# EAGLE design Sirena_555_version_final (EAGLE 7.7.0)
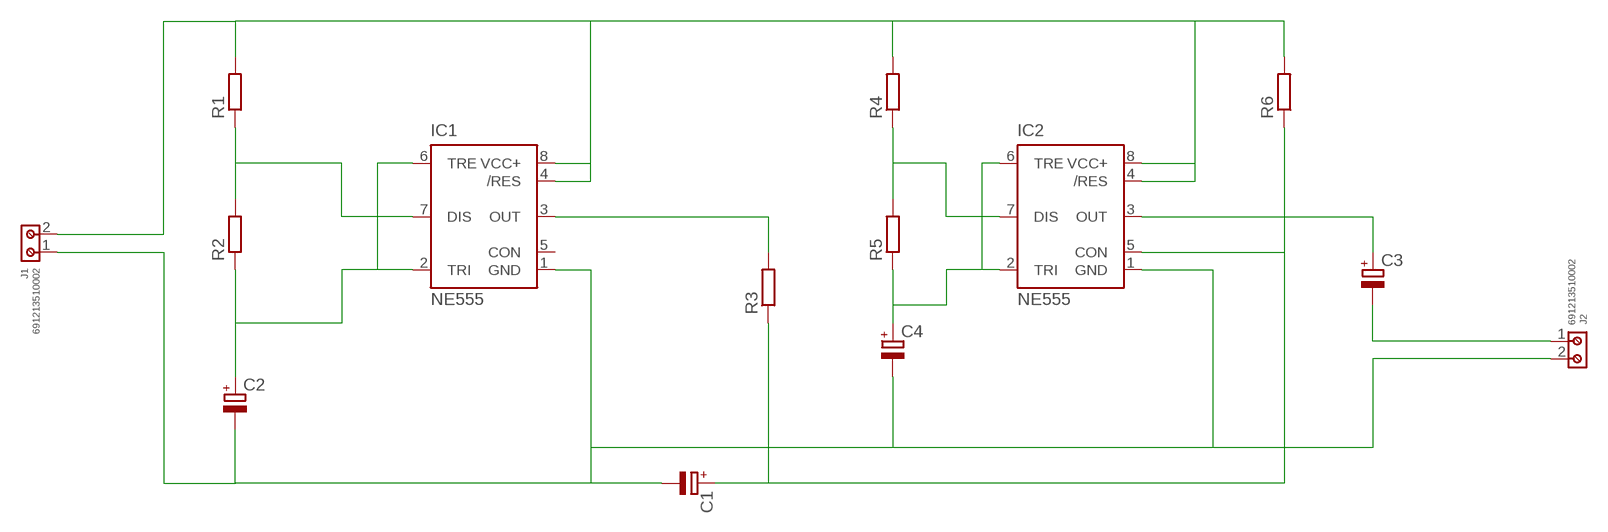
[diagram p0: schematic, sheet 1]

## Parts
C1  CPOL-EUE3.5-10  [E3,5-10]
C2  CPOL-EUE2.5-5  [E2,5-5]
C3  CPOL-EUE2.5-5  [E2,5-5]
C4  CPOL-EUE2-4  [E2-4]
IC1  NE555  [DIL-08]
IC2  NE555  [DIL-08]
J1  691213510002  [691213510002]
J2  691213510002  [691213510002]
R1  R-EU_0309/12  [0309/12]
R2  R-EU_0309/12  [0309/12]
R3  R-EU_0309/12  [0309/12]
R4  R-EU_0309/12  [0309/12]
R5  R-EU_0309/12  [0309/12]
R6  R-EU_0309/12  [0309/12]

## Nets
GROUND: C1.- C2.- C4.- IC1.1(GND) IC2.1(GND) J1.1 J2.2
N$1: IC1.4(/RES) IC1.8(VCC+) IC2.4(/RES) IC2.8(VCC+) J1.2 R1.2 R4.2 R6.2
N$3: IC1.7(DIS) R1.1 R2.2
N$4: C2.+ IC1.2(TRI) IC1.6(TRE) R2.1
N$5: C4.+ IC2.2(TRI) IC2.6(TRE) R5.1
N$9: IC1.3(OUT) R3.2
N$10: C1.+ IC2.5(CON) R3.1 R6.1
N$11: C3.- J2.1
N$12: IC2.7(DIS) R4.1 R5.2
N$15: C3.+ IC2.3(OUT)
Unconnected: IC1.5(CON)

## Library data of the parts
C1-C4 = rcl:CPOL-EU: POLARIZED CAPACITOR, European symbol
IC1 IC2 = st-microelectronics:NE555: General purpose bipolar Timer; MF: Arrow Electronics; MPN: NE555N; OC_FARNELL: 1467742; OC_NEWARK: 89K1486
J1 J2 = 691213510002:691213510002: WR-TBL Serie 2135 - 5.08 mm Horizontal Entry Modular w. Rising Cage Clamp KIND PROPERTIES Pitch 5.08 mm MATERIAL PROPERTIES Insulator Material PA66 Insulator Flammability Rating UL94 V-0 Contact Material Copper Alloy Contact Plating Tin over Nickel Contact Type Stamped Terminal Screw Material Steel Terminal Screw Plating Zinc Wire Guard Material Copper Alloy GENERAL INFORMATION Operating Temperature -30 up to +120 °C Compliance ROHS & Reach ELECTRICAL PROPERTIES IR UL 14 A IR VDE 14 A Working Voltage [UL] 300 V (AC) Working Voltage [VDE] 250 V (AC) Withstanding Voltage [UL] 1600 V (AC) Withstanding Voltage [VDE] 2000 V (AC) Contact Resistance 20 mΩ MECHANICAL PROPERTIES Wire Strip Length 6 Screw M3 CERTIFICATION UL Approval E150931 VDE Approval 40021366 PACKAGING PROPERTIES Packaging Box <https://www.we-online.com/catalog/media/o32805v209%20Family_WR-TBL2_Series2135.jpg> Details see: https://www.we-online.com/catalog/en/TBL_5_08_2135_HORIZONTAL_ENTRY_MODULAR_69121351000x/ Updated by Ella Wu 2019-11-26 2019(C) Wurth Elektronik Check availability <https://pricing.snapeda.com/parts/691213510002/Wurth%20Electronics/view-part?ref=eda>; AVAILABILITY: In Stock; CHECK_PRICES: https://www.snapeda.com/parts/691213510002/Wurth+Electronics/view-part/?ref=eda; DESCRIPTION: 2 Position Wire to Board Terminal Block Horizontal with Board 0.200 (5.08mm) Through Hole; MF: Wurth Electronics; MP: 691213510002; PACKAGE: None; PRICE: None; SNAPEDA_LINK: https://www.snapeda.com/parts/691213510002/Wurth+Electronics/view-part/?ref=snap
R1-R6 = rcl:R-EU_: RESISTOR, European symbol

## Board
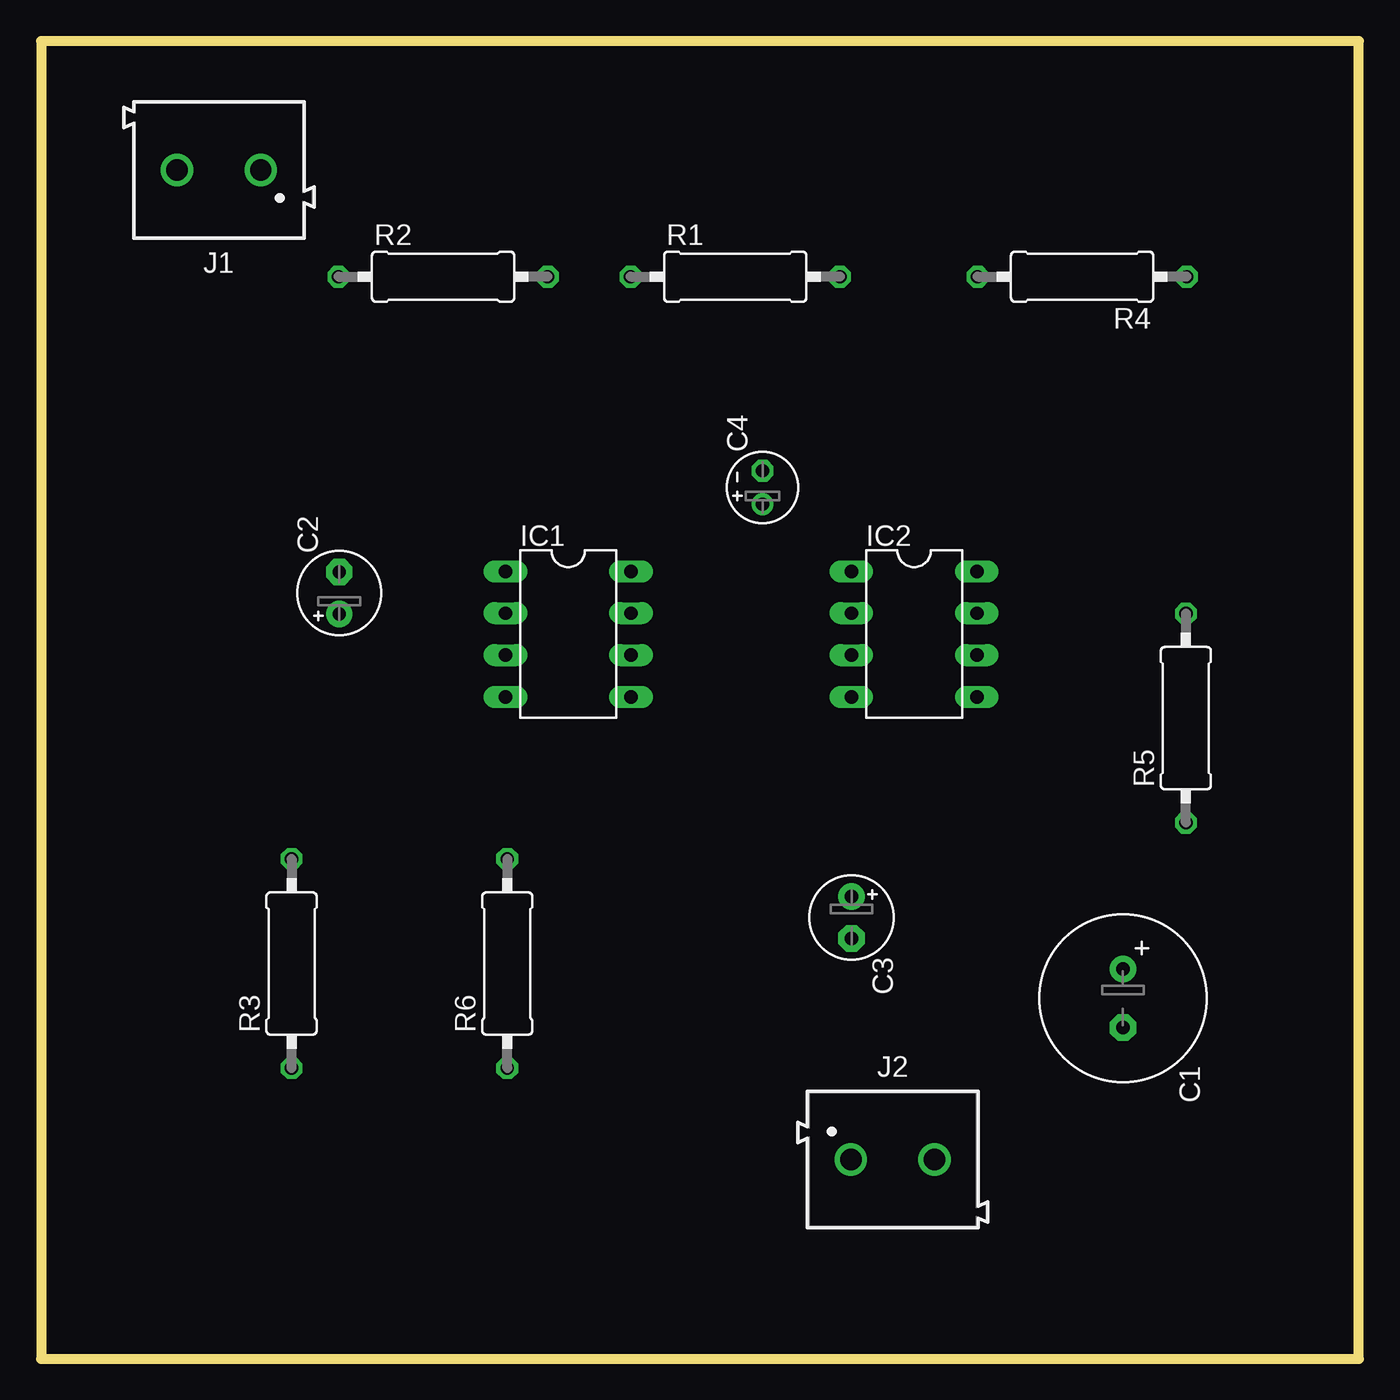
[diagram p1: board, top side]
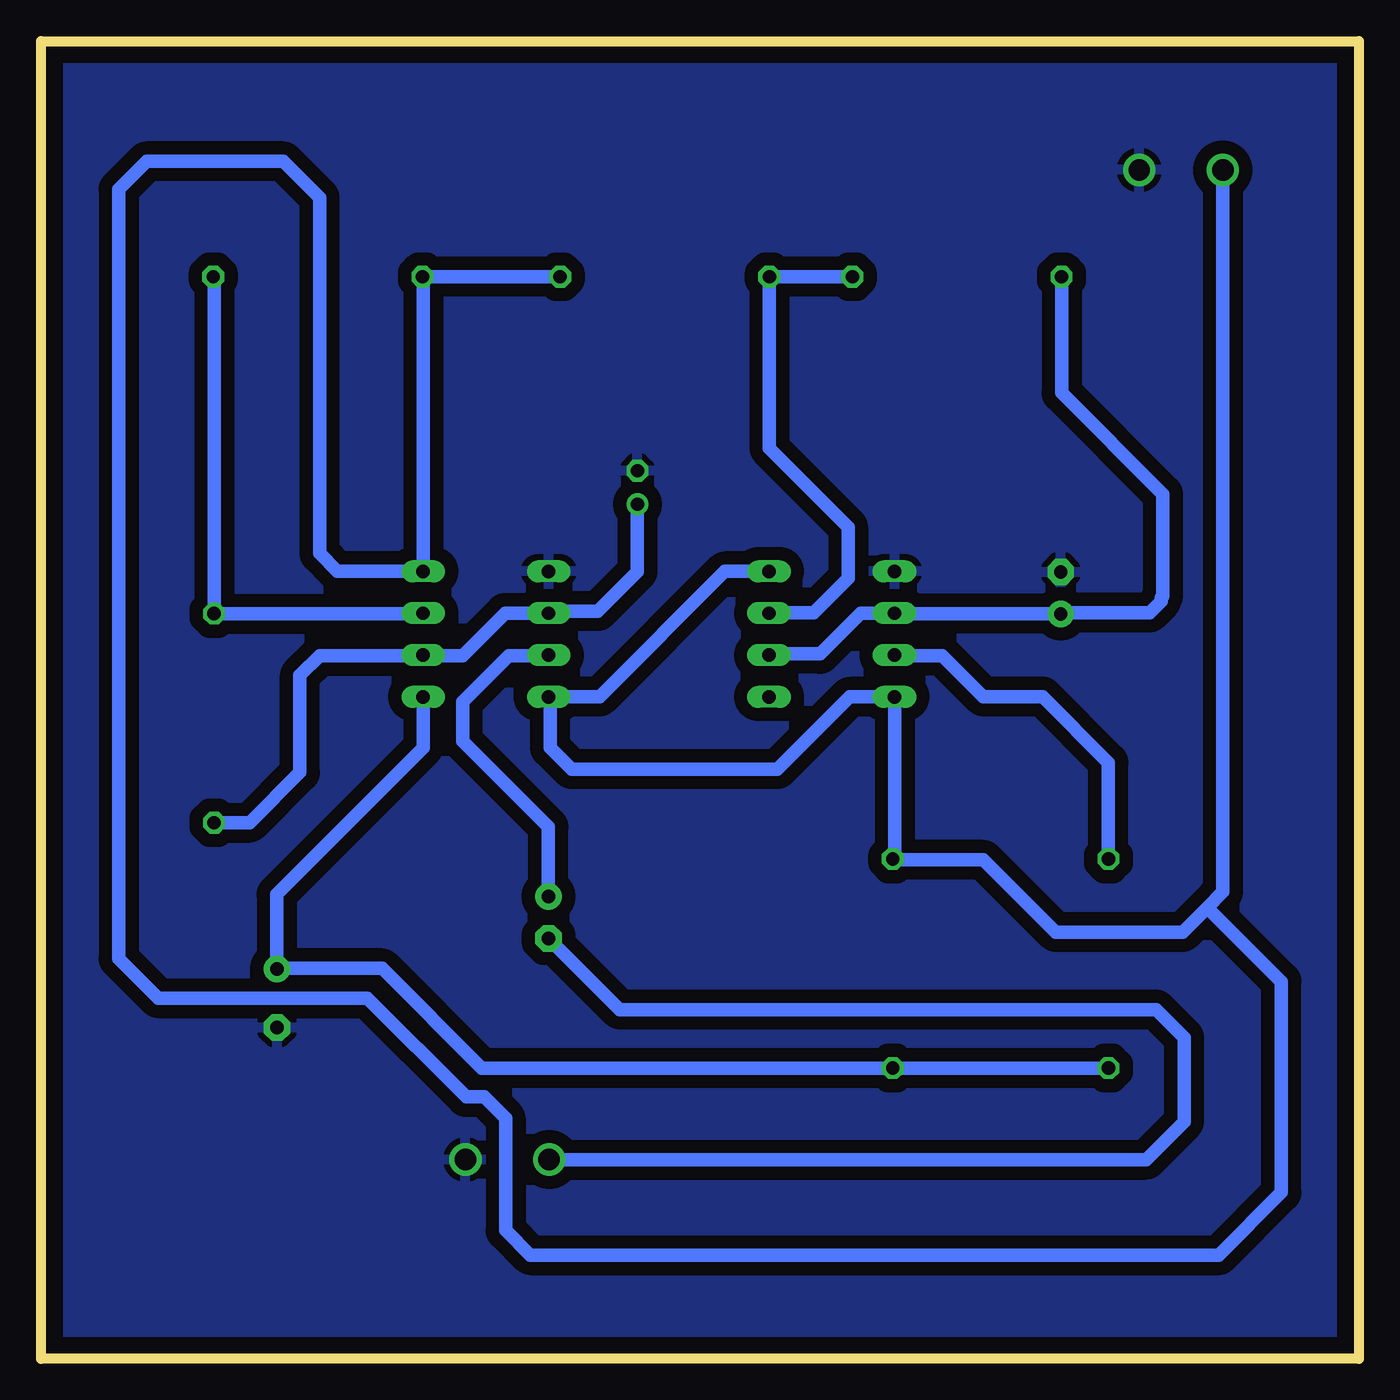
[diagram p2: board, bottom side, seen from below]

Size 80 x 80 mm. Coordinates in mm from the lower left corner, seen from the top.
Outline: 0,0 80,0 80,80 0,80 0,0
Copper layers (1*16): Top 0.035mm / dielectric 1.5mm / Bottom 0.035mm
Design rules "default *": minimum track width 24mil, minimum drill 24mil, track to track 11mil, track to pad 11mil, pad to pad 11mil, via to via 11mil, smd to smd 8mil, copper to edge 40mil, drill to drill 8mil, minimum pad ring 10mil, minimum via ring 8mil, stop-mask expansion 4mil, vias tented up to drill 0mil, thermal gap 15mil

### Footprints (pad centres in the part's own frame; a part is rotated, then mirrored left to right if it is on the bottom)
E3,5-10 = drill 0.813 pad 1.6: + -1.778,0 | drill 0.813 pad 1.6 octagon: - 1.778,0
E2,5-5 = drill 0.813 pad 1.6: + -1.27,0 | drill 0.813 pad 1.6 octagon: - 1.27,0
E2-4 = drill 0.813 pad 1.27: + -1.016,0 | drill 0.813 pad 1.27 octagon: - 1.016,0
DIL-08 = drill 0.813 long: 1 -3.81,-3.81; 2 -1.27,-3.81; 3 1.27,-3.81; 4 3.81,-3.81; 5 3.81,3.81; 6 1.27,3.81; 7 -1.27,3.81; 8 -3.81,3.81
691213510002 = drill 1.3: 1 -2.54,0; 2 2.54,0
0309/12 = drill 0.813 octagon: 1 -6.35,0; 2 6.35,0

### Placement (x,y rotation side)
C1  65.68,21.89 270 top
C2  18.1,46.5 90 top
C3  49.2,26.8 270 top
C4  43.8,52.9 90 top
IC1  32,44 270 top
IC2  53,44 270 top
J1  10.79,72.18 180 top
J2  51.7,12.1 0 top
R1  42.14,65.7 0 top
R2  24.4,65.7 0 top
R3  15.2,24 90 top
R4  63.2,65.7 180 top
R5  69.5,38.9 90 top
R6  28.3,24 90 top

### Tracks (layer width: path | path; a pad name or v marks a point on that pad's centre or on a via)
GROUND
  pour Bottom (isolate 0.813): 0,0 80,0 80,80 0,80
N$1
  Bottom 0.813: R1.2 R4.2 56.81,65.7 IC2.8 62.01,47.81 63.1,48.9 63.1,70.5 65.3,72.7 73.6,72.7 75.3,71 75.3,24.3 72.9,21.9 60.2,21.9 54.2,15.9 53.1,15.9 51.8,14.6 51.8,7.8 50.3,6.3 8.5,6.3 4.7,10.1 4.7,22.9 9.2,27.4 | IC1.8 38.49,47.81 46.1,40.2 IC2.4 49.1,40.1 49.1,37.1 47.8,35.8 35.3,35.8 30.91,40.19 IC1.4 28.19,30.36 R6.2 28.25,30.3 22.8,30.3 18.4,25.9 10.7,25.9 9.2,27.4 | J1.2 8.25,28.35 9.2,27.4
N$3
  Bottom 0.813: R2.2 R1.1 35.79,55.29 31,50.5 31,47.4 33.1,45.3 35.78,45.3 IC1.7
N$4
  Bottom 0.813: R2.1 18.05,58.65 11.9,52.5 11.9,46.3 12,46.2 12,46 12.7,45.3 18.03,45.3 C2.+ 28.15,45.23 IC1.2 30.23,45.27 32.7,42.8 35.74,42.8 IC1.6
N$5
  Bottom 0.813: C4.+ 43.8,47.8 46.2,45.4 49.06,45.4 IC2.2 51.83,45.27 54.4,42.7 56.78,42.7 IC2.6 56.84,42.7 63.1,42.7 64.3,41.5 64.3,35.6 67.35,32.55 R5.1
N$9
  Bottom 0.813: R3.2 15.2,36.2 19.2,40.2 22.8,40.2 25.3,42.7 28.16,42.7 IC1.3
N$10
  Bottom 0.813: R3.1 R6.1 53.25,17.65 59.3,23.7 65.65,23.7 C1.+ 65.7,23.69 65.7,28.2 56.81,37.09 IC2.5
N$11
  Bottom 0.813: 49.16,25.49 C3.- 44.87,21.2 12.3,21.2 10.6,19.5 10.6,14.4 12.9,12.1 J2.1
N$12
  Bottom 0.813: R4.1 69.5,65.7 R5.2 56.81,45.25 IC2.7
N$15
  Bottom 0.813: C3.+ 49.2,32.3 54.4,37.5 54.4,39.9 51.6,42.7 49.22,42.7 IC2.3